# Altium schematic sheet noeud2.SchDoc
size A4
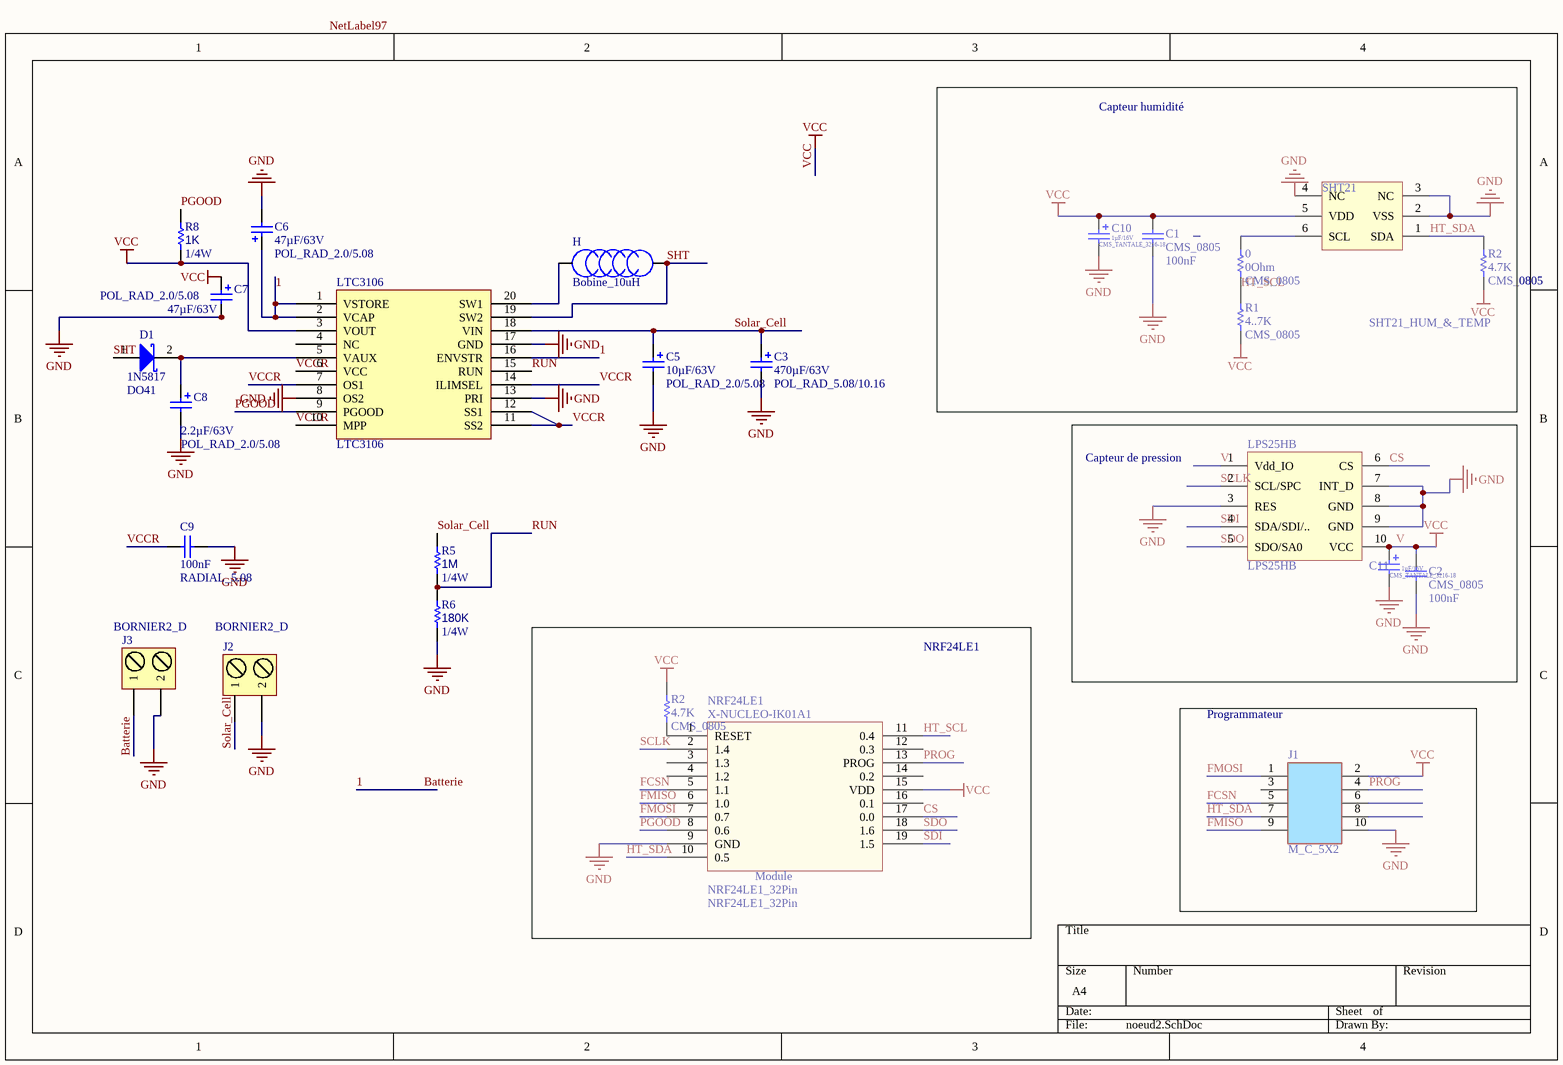
[diagram p0: noeud2.SchDoc]

## Parts
(Parts that share a designator on the sheet are numbered #1, #2 ... from top to bottom, then left to right.)
0  value 0Ohm  Type: CMS_0805  [RESISTANCE_CMS_0805]  (hidden comment: RESISTANCE_CMS_0805)
C1  value 100nF  [CONDENSATEUR_CMS_0805]  (hidden comment: CMS_0805)
C2  value 100nF  [CONDENSATEUR_CMS_0805]  (hidden comment: CMS_0805)
C3  value 470µF/63V  Type: POL_RAD_5.08/10.16  [CONDENSATEUR_POLARISE_ELECTROLYTIQUE_RADIAL_5.08/10.16]  (hidden comment: CONDENSATEUR_POL_ELECTROLY_RAD_5.08/10.16)
C5  value 10µF/63V  Type: POL_RAD_2.0/5.08  [CONDENSATEUR_POLARISE_ELECTROLYTIQUE_RADIAL_2.0/5.08]  (hidden comment: CONDENSATEUR_POL_ELECTROLY_RAD_2.0/5.08)
C6  value 47µF/63V  Type: POL_RAD_2.0/5.08  [CONDENSATEUR_POLARISE_ELECTROLYTIQUE_RADIAL_2.0/5.08]  (hidden comment: CONDENSATEUR_POL_ELECTROLY_RAD_2.0/5.08)
C7  value 47µF/63V  Type: POL_RAD_2.0/5.08  [CONDENSATEUR_POLARISE_ELECTROLYTIQUE_RADIAL_2.0/5.08]  (hidden comment: CONDENSATEUR_POL_ELECTROLY_RAD_2.0/5.08)
C8  value 2.2µF/63V  Type: POL_RAD_2.0/5.08  [CONDENSATEUR_POLARISE_ELECTROLYTIQUE_RADIAL_2.0/5.08]  (hidden comment: CONDENSATEUR_POL_ELECTROLY_RAD_2.0/5.08)
C9  value 100nF  Type: RADIAL_5.08  [CONDENSATEUR_CERAMIQUE_RADIAL_5.08]  (hidden comment: CONDENSATEUR_CER_RAD_5.08)
C10  value 1µF/16V  Type: CMS_TANTALE_3216-18  [CONDENSATEUR_CMS_POLARISE_TANTALE_A/3216-18]  (hidden comment: CMS_POLARISE_TANTALE_3216-18)
C11  value 1µF/16V  Type: CMS_TANTALE_3216-18  [CONDENSATEUR_CMS_POLARISE_TANTALE_A/3216-18]  (hidden comment: CMS_POLARISE_TANTALE_3216-18)
D1  Type: 1N5817  Package: DO41  [DIODE_DO41]  (hidden comment: DIODE_SCHOTTKY_DO41 : 1N5817)
H  Type: Bobine_10uH  [SELF]  (hidden comment: Bobine_22nH)
J1  Type: M_C_5X2  [BARRETTE_5X2_M_C]  (hidden comment: BARRETTE_5 CONTACTS_2 RANGEES_MALE_COUDEE)
J2  Type: BORNIER2_D  [BORNIER2_A_VIS]  (hidden comment: BORNIER2 DROIT A VIS)
J3  Type: BORNIER2_D  [BORNIER2_A_VIS]  (hidden comment: BORNIER2 DROIT A VIS)
LPS25HB  Type: LPS25HB  [LPS25HB_HLGA_10]  (hidden comment: LPS25HB Pressure sensor)
LTC3106  LTC3106_Regulateur  [ltc3106]  (value not drawn)
NRF24LE1  NRF24LE1_32Pin  [NRF24LE1 SMD]
R1  value 4..7K  Type: CMS_0805  [RESISTANCE_CMS_0805]  (hidden comment: RESISTANCE_CMS_0805)
R2#1  value 4.7K  Type: CMS_0805  [RESISTANCE_CMS_0805]  (hidden comment: RESISTANCE_CMS_0805)
R2#2  value 4.7K  Type: CMS_0805  [RESISTANCE_CMS_0805]  (hidden comment: RESISTANCE_CMS_0805)
R5  value 1M  Type: 1/4W  [RESISTANCE_1/4W]  (hidden comment: RESISTANCE_AXIALE_1/4W)
R6  value 180K  Type: 1/4W  [RESISTANCE_1/4W]  (hidden comment: RESISTANCE_AXIALE_1/4W)
R8  value 1K  Type: 1/4W  [RESISTANCE_1/4W]  (hidden comment: RESISTANCE_AXIALE_1/4W)
SHT21  Type: SHT21_HUM_&_TEMP  (hidden comment: SHT21 HUM & TEMP)

## Blocks framed on the sheet
Capteur humidité: 0 C1 C10 R1 R2#1 SHT21
Capteur de pression: C2 C11 LPS25HB
NRF24LE1: NRF24LE1 R2#2
Programmateur: J1

## Nets
GND: C1.1 C2.1 C3.2 C5.2 C6.2 C7.2 C8.2 C9.2 C10.2 C11.2 J1.10 J2.2 J3.2 LPS25HB.3(RES) LPS25HB.7(INT_D) LPS25HB.8(GND) LPS25HB.9(GND) LTC3106.8(OS2) LTC3106.13(PRI) LTC3106.17(GND) NRF24LE1.9(GND) R6.1 SHT21.2(VSS) SHT21.3(NC) SHT21.4(NC)
V: C1.2 C2.2 C7.1 C10.1 C11.1 J1.2 LPS25HB.1(Vdd_IO) LPS25HB.10(VCC) LTC3106.3(VOUT) NRF24LE1.15(VDD) R1.2 R2#1.2 R2#2.2 R8.1 SHT21.5(VDD)  [also labelled VCC]
1: C6.1 J3.1 LTC3106.1(VSTORE) LTC3106.2(VCAP) LTC3106.16(ENVSTR)  [also labelled Batterie]
CS: LPS25HB.6(CS) NRF24LE1.17(0.0)
FCSN: J1.5 NRF24LE1.5(1.1)
FMISO: J1.9 NRF24LE1.6(1.0)
FMOSI: J1.1 NRF24LE1.7(0.7)
HT_SCL: 0.1 NRF24LE1.11(0.4) R1.1
HT_SDA: J1.7 NRF24LE1.10(0.5) R2#1.1 SHT21.1(SDA)
PGOOD: LTC3106.9(PGOOD) NRF24LE1.8(0.6) R8.2
PROG: J1.4 NRF24LE1.13(PROG)
RUN: LTC3106.15(RUN) R5.1 R6.2
SCLK: LPS25HB.2(SCL/SPC) NRF24LE1.2(1.4)
SDI: LPS25HB.4(SDA/SDI/..) NRF24LE1.19(1.5)
SDO: LPS25HB.5(SDO/SA0) NRF24LE1.18(1.6)
SHT: D1.1 H.2 LTC3106.19(SW2)
Solar_Cell: C3.1 C5.1 J2.1 LTC3106.18(VIN) R5.2
VCCR: C9.1 LTC3106.6(VCC) LTC3106.7(OS1) LTC3106.10(MPP) LTC3106.11(SS2) LTC3106.12(SS1) LTC3106.14(ILIMSEL)
Net0_2: 0.2 SHT21.6(SCL)
NetC8_1: C8.1 D1.2 LTC3106.5(VAUX)
NetH_1: H.1 LTC3106.20(SW1)
NetNRF24LE1_1: NRF24LE1.1(RESET) R2#2.1

Not connected (* = marked no-connect by the designer): J1 3 6 8; LTC3106 4(NC); NRF24LE1 3(1.3) 4(1.2) 12(0.3) 14(0.2) 16(0.1)

## Notes on the sheet
- Labels drawn without touching a wire or pin: NetLabel97
- (in symbol NRF24LE1_32Pin) X-NUCLEO-IK01A1; Module

## Library data of the parts
0 R1 R2#1 R2#2 = RESISTANCE_CMS_0805: RESISTANCE CMS 0805
C1 C2 = CONDENSATEUR_CMS_CER_0805: CONDENSATEUR CMS CERAMIQUE 0805; Type: CMS_0805
C3 = CONDENSATEUR_POL_ELECTROLY_RAD_5.08/10.16: CONDENSATEUR POLARISE ELECTROLYTIQUE RADIAL 5.08/10.16
C5-C8 = CONDENSATEUR_POL_ELECTROLY_RAD_2.0/5.08: CONDENSATEUR POLARISE ELECTROLYTIQUE RADIAL 2.0/5.08
C9 = CONDENSATEUR_CER_RAD_5.08: CONDENSATEUR TRAVERSANT CERAMIQUE RADIAL 5.08mm
C10 C11 = CONDENSATEUR_CMS_POL_TANT_A_3216-18: CONDENSATEUR CMS POLARISE TANTALE BOITIER A/3216-18
D1 = DIODE_SCHOTTKY_DO41 : 1N5817: DIODE SCHOTTKY DO41 : 1N5817
J1 = BARRETTE_5 CONTACTS_2 RANGEES_MALE_COUDEE: BARRETTE 5 CONTACTS 2 RANGEES MALE COUDEE
J2 J3 = BORNIER2_DROIT_A VIS: BORNIER 2 PLOTS DROIT A VIS 5.08mm
LPS25HB = LPS25HB_Pression Sensor: LPS25HB_Pressure_Sensor
LTC3106 = LTC31068FE PACKAGE: LTC3106_Regulateur_MPC; Type: LTC3106
R5 R6 R8 = RESISTANCE_AXIALE_1/4W: RESISTANCE TRAVERSANTE AXIALE 1/4W
SHT21 = SHT21_HUM_&_TEMP_Sensors_DFN: SHT21 HUM & TEMP Sensors DFN